# Altium schematic sheet Motherboard.SchDoc
size 762 x 381 mm
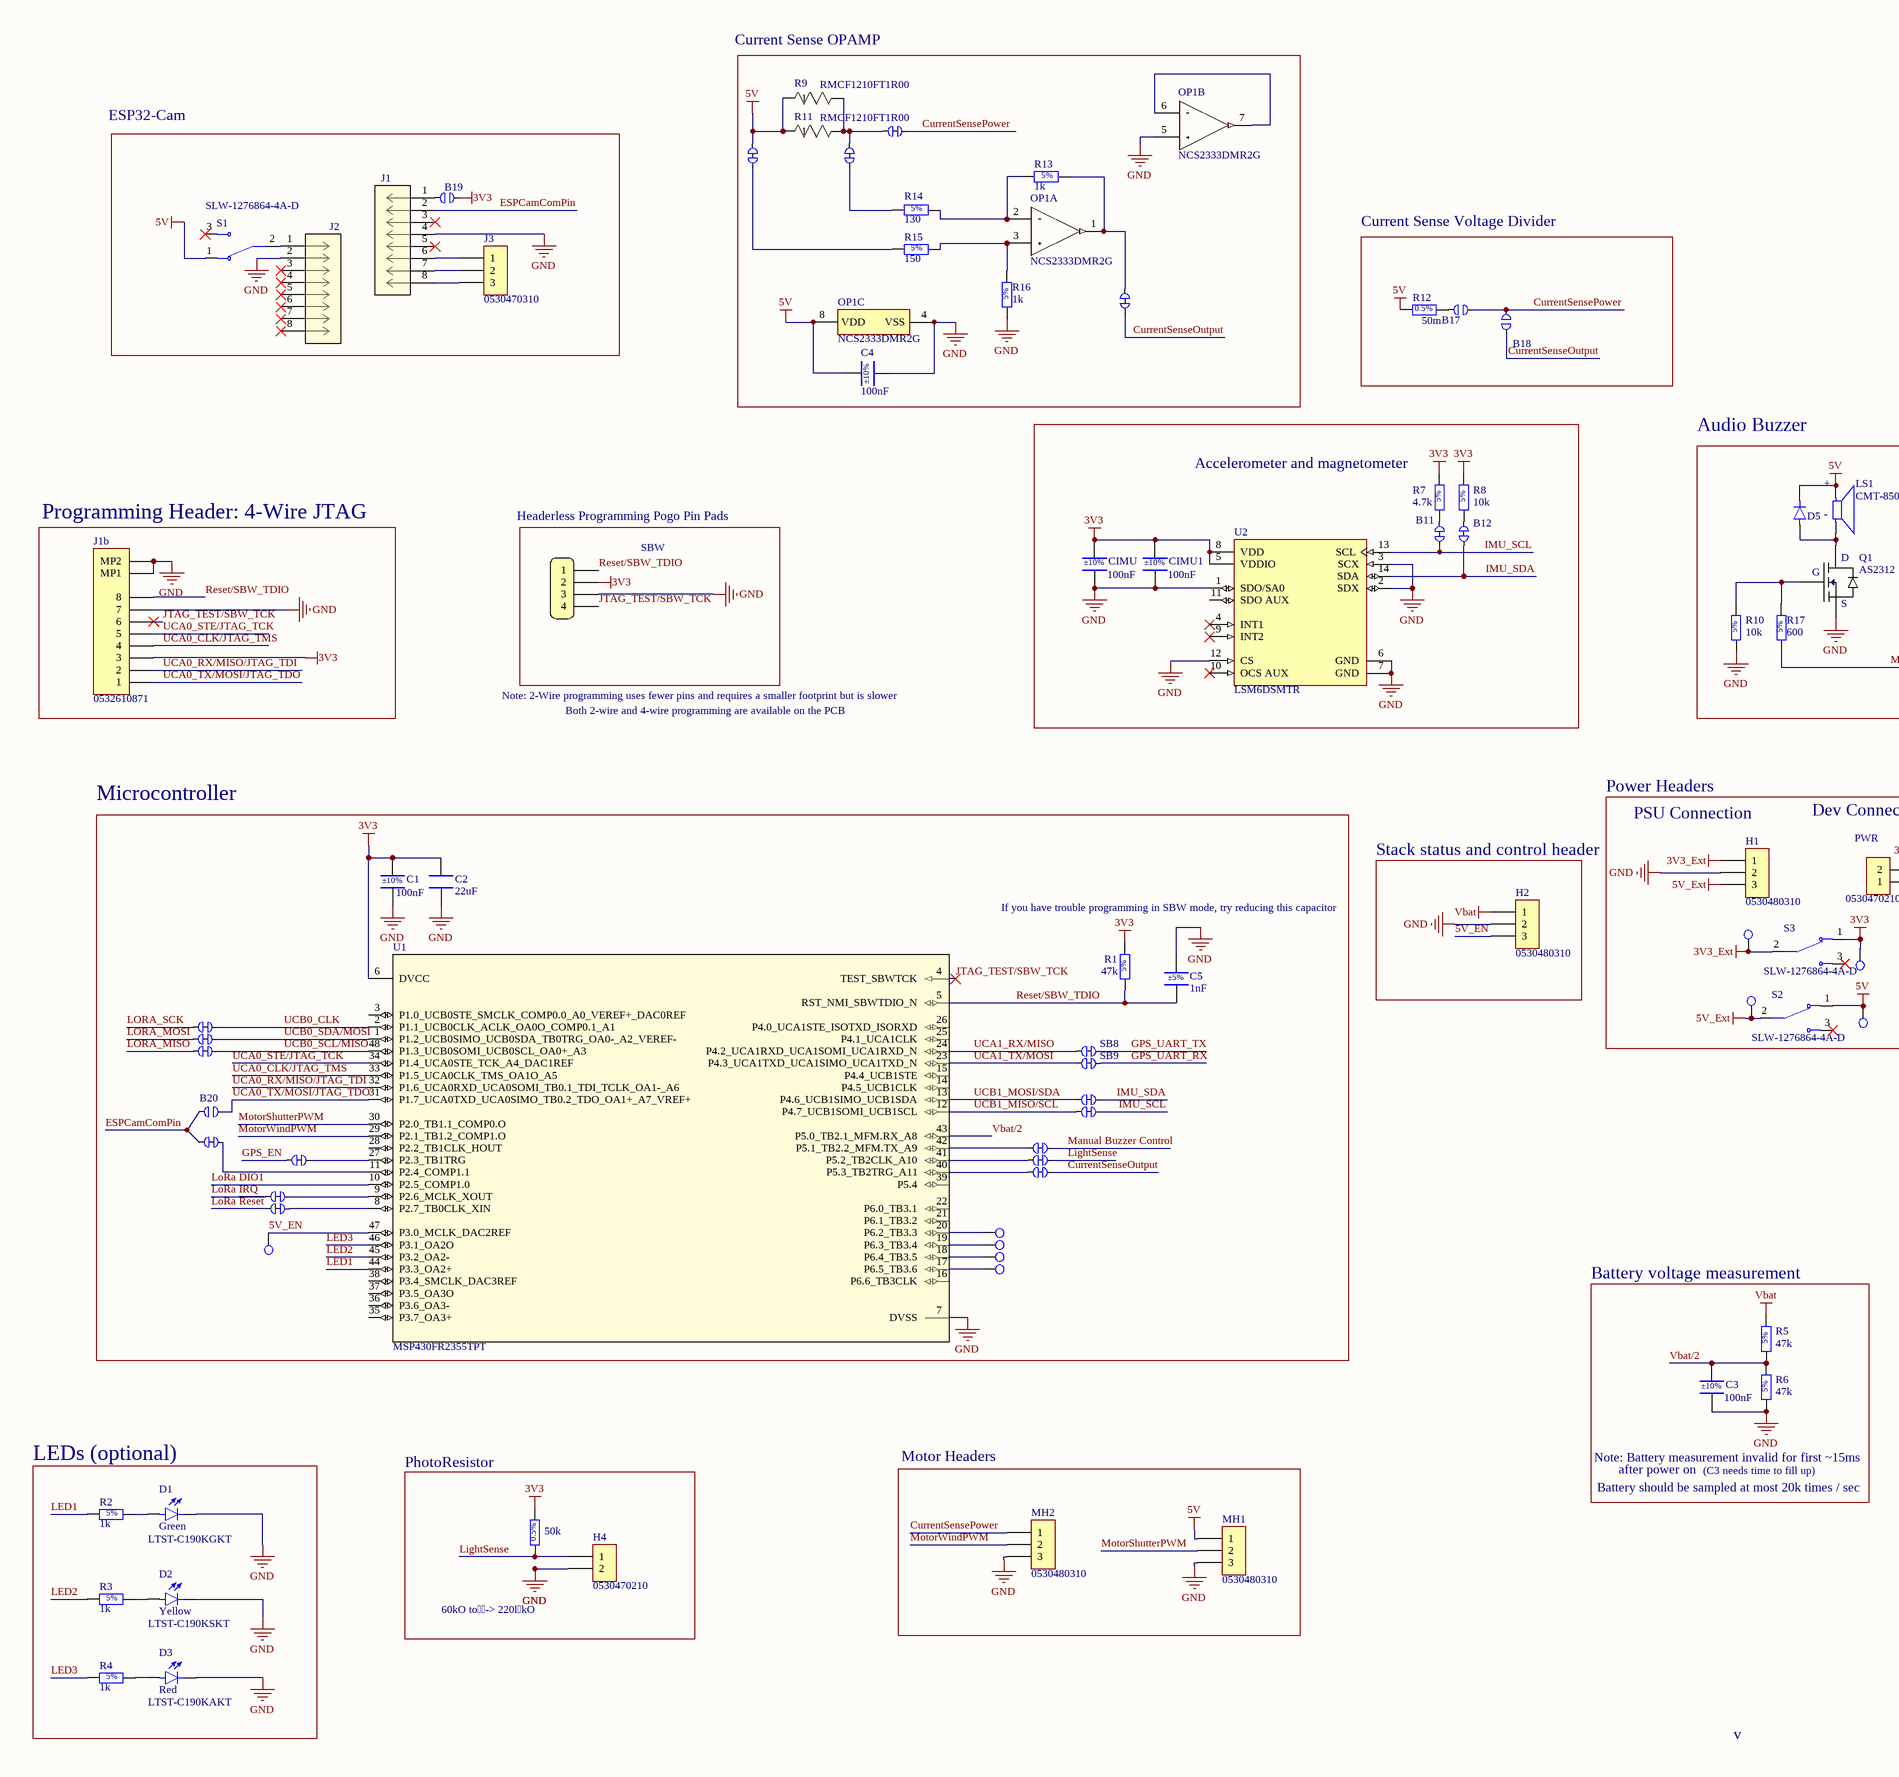
[diagram p0: Motherboard.SchDoc, left]
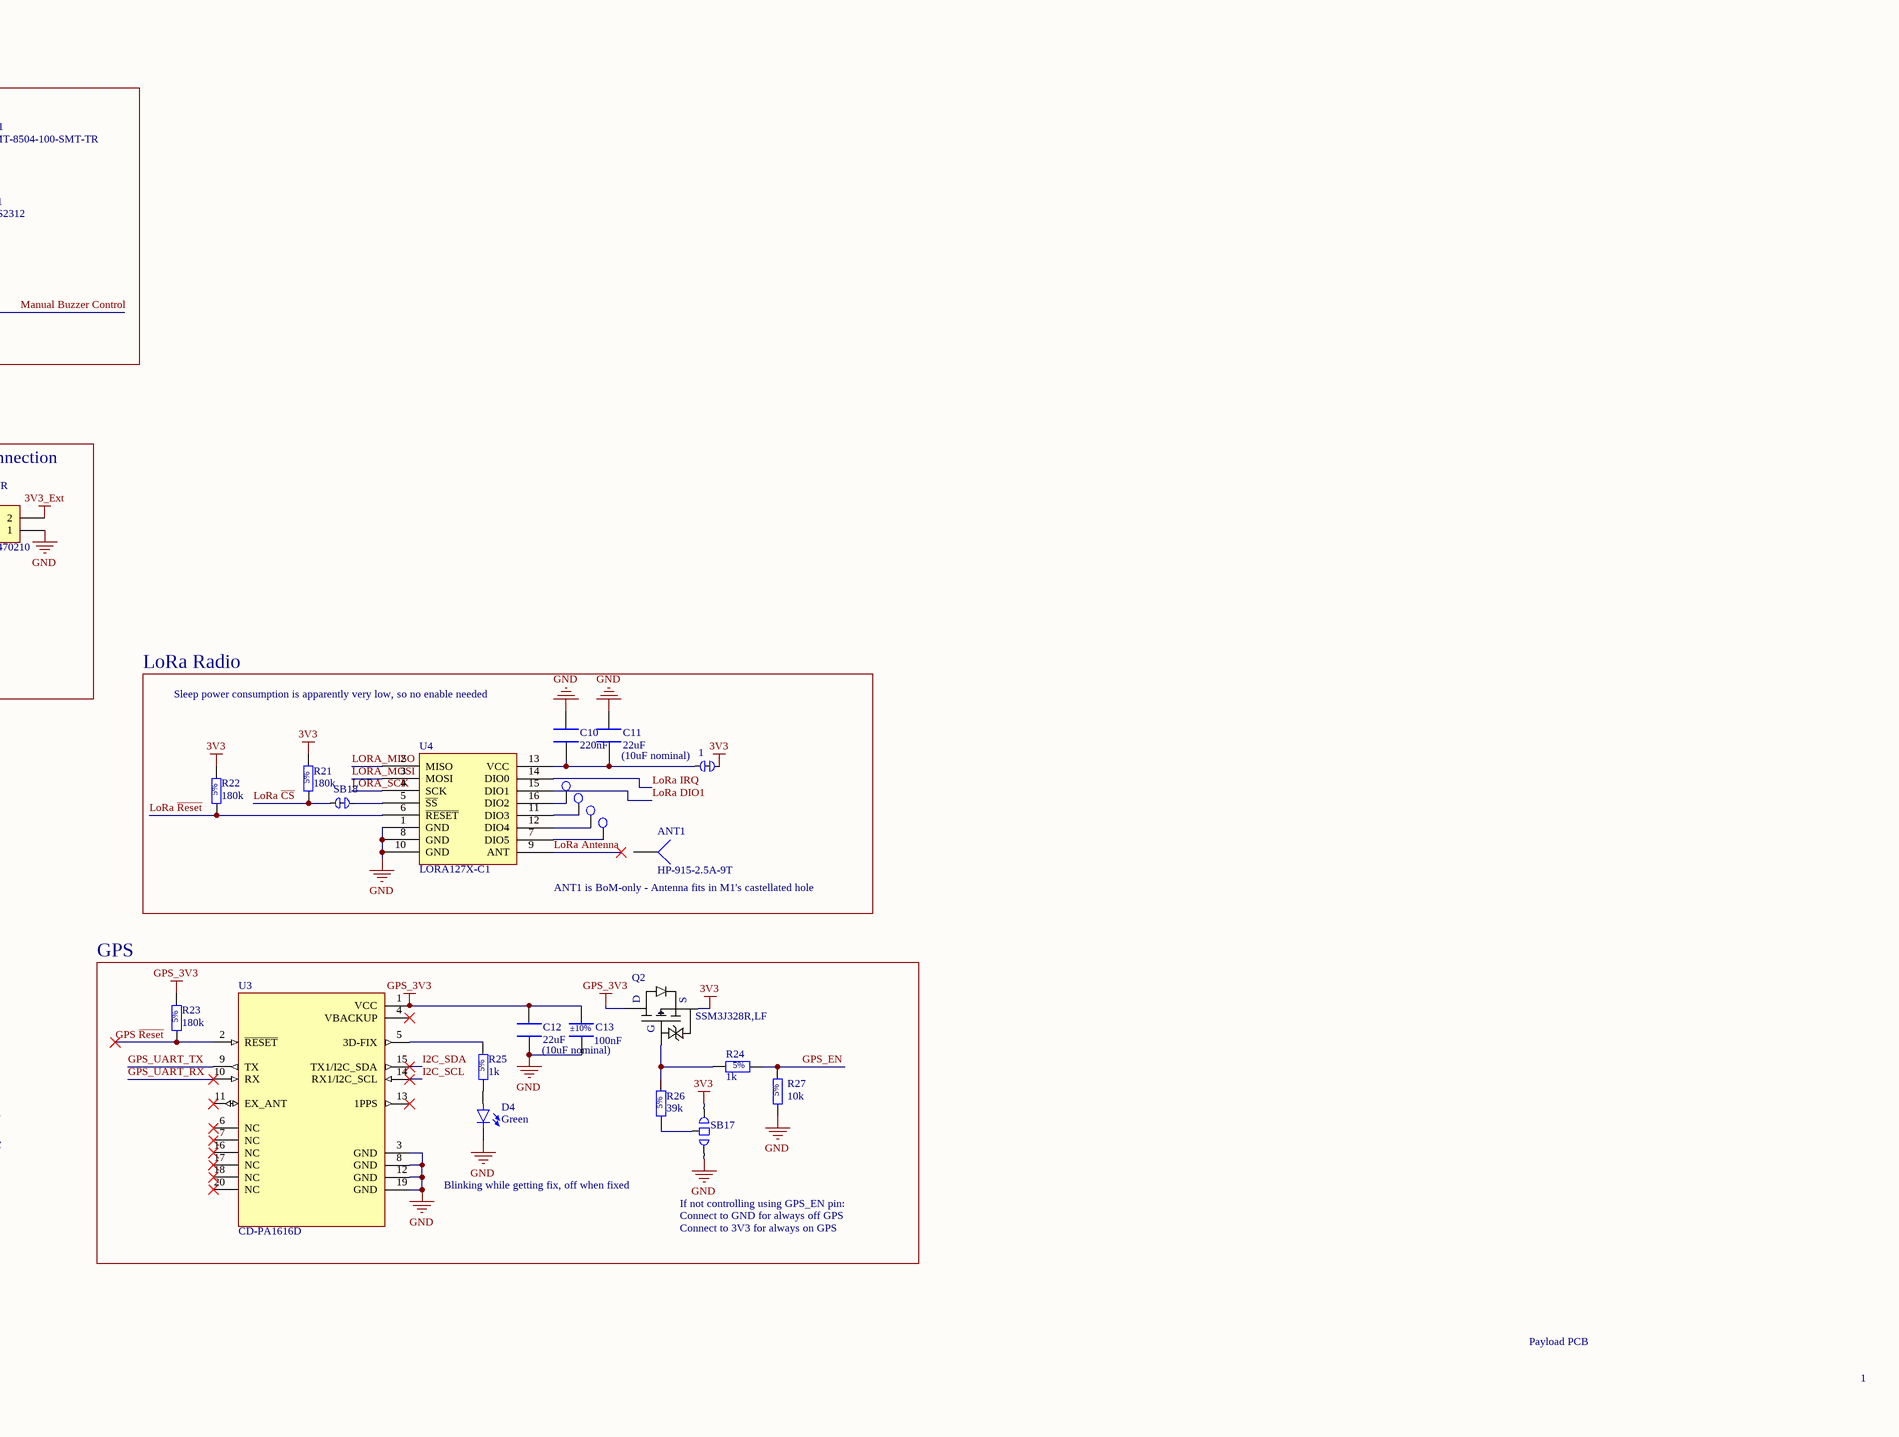
[diagram p1: Motherboard.SchDoc, right]

## Parts
1  Solder Jumper Normally Closed 0201  [Solder Bridge Closed 0201]  (value not drawn)  (net tie, no BOM)
50k  (no value)  [Resistor_0805_2012M-50N]
ANT1  HP-915-2.5A-9T  (mechanical)
B11  Solder Jumper Normally Closed 0201  [Solder Bridge Closed 0201]  (value not drawn)  (net tie, no BOM)
B12  Solder Jumper Normally Closed 0201  [Solder Bridge Closed 0201]  (value not drawn)  (net tie, no BOM)
B17  Solder Jumper Normally Open 0201  [Solder Bridge Open 0201]  (value not drawn)  (no BOM)
B18  Solder Jumper Normally Open 0201  [Solder Bridge Open 0201]  (value not drawn)  (no BOM)
B19  Solder Jumper Normally Open 0201  [Solder Bridge Open 0201]  (value not drawn)  (no BOM)
B20  Solder Jumper Normally Open 0201  [Solder Bridge Open 0201]  (value not drawn)  (no BOM)
C1  100nF  [CAPACITOR_0805_2012M-70N]
C2  22uF  [CAPACITOR_0805_2012M-70N]
C3  100nF  [CAPACITOR_0805_2012M-70N]
C4  100nF  [CAPACITOR_0805_2012M-70N]
C5  1nF  [CAPACITOR_0805_2012M-70N]
C10  220nF  [CAPACITOR_0805_2012M-70N]
C11  22uF  [CAPACITOR_0805_2012M-70N]
C12  22uF  [CAPACITOR_0805_2012M-70N]
C13  100nF  [CAPACITOR_0805_2012M-70N]
CIMU  100nF  [CAPACITOR_0805_2012M-70N]
CIMU1  100nF  [CAPACITOR_0805_2012M-70N]
D1  MF Part No.: LTST-C190KGKT  Colour: Green  [LED_0603_1608M_0.80mm]  (hidden comment: LTST-C190 Series)
D2  MF Part No.: LTST-C190KSKT  Colour: Yellow  [LED_0603_1608M_0.80mm]  (hidden comment: LTST-C190 Series)
D3  MF Part No.: LTST-C190KAKT  Colour: Red  [LED_0603_1608M_0.80mm]  (hidden comment: LTST-C190 Series)
D4  Colour: Green  [LED_0603_1608M_0.80mm]  (hidden comment: LTST-C190 Series)
D5  1N4148W-TP  [SOD123-1.35mm-N]  (value not drawn)
H1  0530480310  [MOLEX_0530480310]
H2  0530480310  [MOLEX_0530480310]
H4  0530470210  [MOLEX_0530470210]
J1  PPTC081LFBN-RC  [CONN_PPTC081LFBN-RC_SUL]  (value not drawn)
J1b  0532610871  [MOLEX_0532610871]
J2  (no value)  [CONN_PPTC081LFBN-RC_SUL]
J3  0530470310  [MOLEX_0530470310]
LS1  CMT-8504-100-SMT-TR  [XDCR_CMT-8504-100-SMT-TR]
MH1  0530480310  [MOLEX_0530480310]
MH2  0530480310  [MOLEX_0530480310]
OP1  NCS2333DMR2G  [MSOP-8N-3mmBody-1.1mm]  (parts A,B,C of 3)
PP2  Headerless Pogo Holes 4-pin  [POGO_4_PIN_HEADER]  (value not drawn)  (no BOM)
PWR  0530470210  [MOLEX_0530470210]
Q1  AS2312  [SOT23-3N-1.15mm]
Q2  SSM3J328R,LF  [SOT23F-3-0.8mm]
R1  47k  [Resistor_0805_2012M-50N]
R2  1k  [Resistor_0805_2012M-50N]
R3  1k  [Resistor_0805_2012M-50N]
R4  1k  [Resistor_0805_2012M-50N]
R5  47k  [Resistor_0805_2012M-50N]
R6  47k  [Resistor_0805_2012M-50N]
R7  4.7k  [Resistor_0805_2012M-50N]
R8  10k  [Resistor_0805_2012M-50N]
R9  RMCF1210FT1R00  [STA_RMCF1210_STP]
R10  10k  [Resistor_0805_2012M-50N]
R11  RMCF1210FT1R00  [STA_RMCF1210_STP]
R12  50m  [RESISTOR_1206_3216M_55N]
R13  1k  [Resistor_0805_2012M-50N]
R14  130  [Resistor_0805_2012M-50N]
R15  150  [Resistor_0805_2012M-50N]
R16  1k  [Resistor_0805_2012M-50N]
R17  600  [Resistor_0805_2012M-50N]
R21  180k  [Resistor_0805_2012M-50N]
R22  180k  [Resistor_0805_2012M-50N]
R23  180k  [Resistor_0805_2012M-50N]
R24  1k  [Resistor_0805_2012M-50N]
R25  1k  [Resistor_0805_2012M-50N]
R26  39k  [Resistor_0805_2012M-50N]
R27  10k  [Resistor_0805_2012M-50N]
S1  SLW-1276864-4A-D  [SW_SLW-1276864-4A-D]
S2  SLW-1276864-4A-D  [SW_SLW-1276864-4A-D]
S3  SLW-1276864-4A-D  [SW_SLW-1276864-4A-D]
SB1  Solder Jumper Normally Closed 0201  [Solder Bridge Closed 0201]  (value not drawn)  (net tie, no BOM)
SB2  Solder Jumper Normally Closed 0201  [Solder Bridge Closed 0201]  (value not drawn)  (net tie, no BOM)
SB3  Solder Jumper Normally Closed 0201  [Solder Bridge Closed 0201]  (value not drawn)  (net tie, no BOM)
SB4  Solder Jumper Normally Closed 0201  [Solder Bridge Closed 0201]  (value not drawn)  (net tie, no BOM)
SB5  Solder Jumper Normally Closed 0201  [Solder Bridge Closed 0201]  (value not drawn)  (net tie, no BOM)
SB6  Solder Jumper Normally Closed 0201  [Solder Bridge Closed 0201]  (value not drawn)  (net tie, no BOM)
SB7  Solder Jumper Normally Closed 0201  [Solder Bridge Closed 0201]  (value not drawn)  (net tie, no BOM)
SB8  Solder Jumper Normally Closed 0201  [Solder Bridge Closed 0201]  (value not drawn)  (net tie, no BOM)
SB9  Solder Jumper Normally Closed 0201  [Solder Bridge Closed 0201]  (value not drawn)  (net tie, no BOM)
SB10  Solder Jumper Normally Closed 0201  [Solder Bridge Closed 0201]  (value not drawn)  (net tie, no BOM)
SB11  Solder Jumper Normally Closed 0201  [Solder Bridge Closed 0201]  (value not drawn)  (net tie, no BOM)
SB12  Solder Jumper Normally Closed 0201  [Solder Bridge Closed 0201]  (value not drawn)  (net tie, no BOM)
SB13  Solder Jumper Normally Closed 0201  [Solder Bridge Closed 0201]  (value not drawn)  (net tie, no BOM)
SB14  Solder Jumper Normally Closed 0201  [Solder Bridge Closed 0201]  (value not drawn)  (net tie, no BOM)
SB15  Solder Jumper Normally Closed 0201  [Solder Bridge Closed 0201]  (value not drawn)  (net tie, no BOM)
SB16  Solder Jumper Normally Closed 0201  [Solder Bridge Closed 0201]  (value not drawn)  (net tie, no BOM)
SB17  Solder Jumper 3-pin Normally Open 0201  [Solder Bridge 3-pin Open 0201]  (value not drawn)  (no BOM)
SB18  Solder Jumper Normally Closed 0201  [Solder Bridge Closed 0201]  (value not drawn)  (net tie, no BOM)
SB19  Solder Jumper Normally Closed 0201  [Solder Bridge Closed 0201]  (value not drawn)  (net tie, no BOM)
SB20  Solder Jumper Normally Closed 0201  [Solder Bridge Closed 0201]  (value not drawn)  (net tie, no BOM)
T1  Test Pad  [Test Pad]  (value not drawn)  (no BOM)
T2  Test Pad  [Test Pad]  (value not drawn)  (no BOM)
T3  Test Pad  [Test Pad]  (value not drawn)  (no BOM)
T4  Test Pad  [Test Pad]  (value not drawn)  (no BOM)
T5  Test Pad  [Test Pad]  (value not drawn)  (no BOM)
T6  Test Pad  [Test Pad]  (value not drawn)  (no BOM)
T7  Test Pad  [Test Pad]  (value not drawn)  (no BOM)
T8  Test Pad  [Test Pad]  (value not drawn)  (no BOM)
T9  Test Pad  [Test Pad]  (value not drawn)  (no BOM)
T10  Test Pad  [Test Pad]  (value not drawn)  (no BOM)
T11  Test Pad  [Test Pad]  (value not drawn)  (no BOM)
T12  Test Pad  [Test Pad]  (value not drawn)  (no BOM)
T?  Test Pad  [Test Pad]  (value not drawn)  (no BOM)
U1  MSP430FR2355TPT  [PT0048A_L]
U2  LSM6DSMTR  [FP-LGA-14L-DM00249496-MFG]
U3  CD-PA1616D  [XCVR_CD-PA1616D]
U4  LORA127X-C1  [LoRa127X-C1]

## Blocks framed on the sheet
Current Sense Voltage Divider: B17 B18 R12
Accelerometer and magnetometer: B11 B12 CIMU CIMU1 R7 R8 U2
Audio Buzzer: D5 LS1 Q1 R10 R17
Programming Header: 4-Wire JTAG: J1b
SBW: PP2
Microcontroller: B20 C1 C2 C5 R1 SB5-SB16 SB19 SB20 T5-T8 T? U1
Stack status and control header: H2
LoRa Radio: 1 ANT1 C10 C11 R21 R22 SB18 T1-T4 U4
Battery voltage measurement: C3 R5 R6
GPS: C12 C13 D4 Q2 R23-R27 SB17 U3
LEDs (optional): D1-D3 R2-R4
PhotoResistor: 50k H4
Motor Headers: MH1 MH2

## Nets
3V3: 1.2 50k.2 B19.2 C1.2 C2.2 CIMU.2 CIMU1.2 J1b.3 PP2.2 Q2.2(S) R1.2 R7.2 R8.2 R21.2 R22.2 S3.1 SB17.2 T9.1 U1.6(DVCC) U2.5(VDDIO) U2.8(VDD)
3V3_Ext: H1.1 PWR.2 S3.2 T12.1
5V: C4.2 D5.C LS1.P MH1.1 OP1.8(VDD) R9.1 R11.1 R12.1 S1.1 S2.1 SB2.2 T10.1
5V_Ext: H1.3 S2.2 T11.1
GND: C1.1 C2.1 C3.1 C4.1 C5.2 C10.2 C11.2 C12.1 C13.1 CIMU.1 CIMU1.1 D1.C D2.C D3.C D4.C H1.2 H2.2 H4.2 J1.4 J1b.7 J1b.MP1 J1b.MP2 J2.2 MH1.3 MH2.3 OP1.4(VSS) OP1.5(IN2+) PP2.3 PWR.1 Q1.2(S) R6.1 R10.1 R16.1 R27.1 SB17.3 U1.7(DVSS) U2.1(SDO/SA0) U2.2(SDX) U2.3(SCX) U2.6(GND) U2.7(GND) U2.12(CS) U3.3(GND) U3.8(GND) U3.12(GND) U3.19(GND) U4.1(GND) U4.8(GND) U4.10(GND)
GPS_3V3: C12.2 C13.2 Q2.3(D) R23.2 U3.1(VCC)
Vbat: H2.1 R5.2
5V_EN: H2.3 T?.1 U1.47(P3.0_MCLK_DAC2REF)
CurrentSenseOutput: B18.2 SB4.1 SB20.2
CurrentSensePower: B17.1 B18.1 MH2.1 SB1.2
ESPCamComPin: B20.2 J1.2 SB12.1
GPS ~{Reset}: R23.1 U3.2(~{RESET})
GPS_EN: R24.2 R27.2 SB13.1
GPS_UART_RX: SB9.2 U3.10(RX)
GPS_UART_TX: SB8.2 U3.9(TX)
I2C_SCL: U3.14(RX1/I2C_SCL)
I2C_SDA: U3.15(TX1/I2C_SDA)
IMU_SCL: B11.1 SB11.2 U2.13(SCL)
IMU_SDA: B12.2 SB10.2 U2.14(SDA)
JTAG_TEST/SBW_TCK: J1b.6 PP2.4 U1.4(TEST_SBWTCK)
LED1: R2.1 U1.44(P3.3_OA2+)
LED2: R3.1 U1.45(P3.2_OA2-)
LED3: R4.1 U1.46(P3.1_OA2O)
LightSense: 50k.1 H4.1 SB14.2
LoRa Antenna: U4.9(ANT)
LoRa ~{CS}: R21.1 SB18.1
LoRa DIO1: U1.10(P2.5_COMP1.0) U4.15(DIO1)
LoRa IRQ: SB15.1 U4.14(DIO0)
LoRa ~{Reset}: R22.1 SB16.1 U4.6(~{RESET})
LORA_MISO: SB7.1 U4.2(MISO)
LORA_MOSI: SB6.1 U4.3(MOSI)
LORA_SCK: SB5.1 U4.4(SCK)
Manual Buzzer Control: R17.1 SB19.2
MotorShutterPWM: MH1.2 U1.30(P2.0_TB1.1_COMP0.O)
MotorWindPWM: MH2.2 U1.29(P2.1_TB1.2_COMP1.O)
Reset/SBW_TDIO: C5.1 J1b.8 PP2.1 R1.1 U1.5(RST_NMI_SBWTDIO_N)
UCA0_CLK/JTAG_TMS: J1b.4 U1.33(P1.5_UCA0CLK_TMS_OA1O_A5)
UCA0_RX/MISO/JTAG_TDI: J1b.2 U1.32(P1.6_UCA0RXD_UCA0SOMI_TB0.1_TDI_TCLK_OA1-_A6)
UCA0_STE/JTAG_TCK: J1b.5 U1.34(P1.4_UCA0STE_TCK_A4_DAC1REF)
UCA0_TX/MOSI/JTAG_TDO: B20.1 J1b.1 U1.31(P1.7_UCA0TXD_UCA0SIMO_TB0.2_TDO_OA1+_A7_VREF+)
UCA1_RX/MISO: SB8.1 U1.24(P4.2_UCA1RXD_UCA1SOMI_UCA1RXD_N)
UCA1_TX/MOSI: SB9.1 U1.23(P4.3_UCA1TXD_UCA1SIMO_UCA1TXD_N)
UCB0_CLK: SB5.2 U1.2(P1.1_UCB0CLK_ACLK_OA0O_COMP0.1_A1)
UCB0_SCL/MISO: SB7.2 U1.48(P1.3_UCB0SOMI_UCB0SCL_OA0+_A3)
UCB0_SDA/MOSI: SB6.2 U1.1(P1.2_UCB0SIMO_UCB0SDA_TB0TRG_OA0-_A2_VEREF-)
UCB1_MISO/SCL: SB11.1 U1.12(P4.7_UCB1SOMI_UCB1SCL)
UCB1_MOSI/SDA: SB10.1 U1.13(P4.6_UCB1SIMO_UCB1SDA)
Vbat/2: C3.2 R5.1 R6.2 U1.43(P5.0_TB2.1_MFM.RX_A8)
Net1_1: 1.1 C10.1 C11.1 U4.13(VCC)
NetB11_2: B11.2 R7.1
NetB12_1: B12.1 R8.1
NetB17_2: B17.2 R12.2
NetB19_1: B19.1 J1.1
NetD1_A: D1.A R2.2
NetD2_A: D2.A R3.2
NetD3_A: D3.A R4.2
NetD4_A: D4.A R25.1
NetD5_A: D5.A LS1.N Q1.3(D)
NetJ1_6: J1.6 J3.1
NetJ1_7: J1.7 J3.2
NetJ1_8: J1.8 J3.3
NetJ2_1: J2.1 S1.2
NetOP1_1: OP1.1(OUT1) R13.2 SB4.2
NetOP1_2: OP1.2(IN1-) R13.1 R14.2
NetOP1_3: OP1.3(IN1+) R15.2 R16.2
NetOP1_6: OP1.6(IN2-) OP1.7(OUT1)
NetQ1_1: Q1.1(G) R10.2 R17.2
NetQ2_1: Q2.1(G) R24.1 R26.2
NetR9_2: R9.2 R11.2 SB1.1 SB3.2
NetR14_1: R14.1 SB3.1
NetR15_1: R15.1 SB2.1
NetR25_2: R25.2 U3.5(3D-FIX)
NetR26_1: R26.1 SB17.1(Common)
NetSB12_2: SB12.2 U1.11(P2.4_COMP1.1)
NetSB13_2: SB13.2 U1.27(P2.3_TB1TRG)
NetSB14_1: SB14.1 U1.41(P5.2_TB2CLK_A10)
NetSB15_2: SB15.2 U1.9(P2.6_MCLK_XOUT)
NetSB16_2: SB16.2 U1.8(P2.7_TB0CLK_XIN)
NetSB18_2: SB18.2 U4.5(~{SS})
NetSB19_1: SB19.1 U1.42(P5.1_TB2.2_MFM.TX_A9)
NetSB20_1: SB20.1 U1.40(P5.3_TB2TRG_A11)
NetT1_1: T1.1 U4.16(DIO2)
NetT2_1: T2.1 U4.11(DIO3)
NetT3_1: T3.1 U4.12(DIO4)
NetT4_1: T4.1 U4.7(DIO5)
NetT5_1: T5.1 U1.20(P6.2_TB3.3)
NetT6_1: T6.1 U1.19(P6.3_TB3.4)
NetT7_1: T7.1 U1.18(P6.4_TB3.5)
NetT8_1: T8.1 U1.17(P6.5_TB3.6)

Not connected (* = marked no-connect by the designer): ANT1 1; J1 3* 5*; J2 3* 4* 5* 6* 7* 8*; S1 3*; S2 3*; S3 3*; U1 3(P1.0_UCB0STE_SMCLK_COMP0.0_A0_VEREF+_DAC0REF) 14(P4.5_UCB1CLK) 15(P4.4_UCB1STE) 16(P6.6_TB3CLK) 21(P6.1_TB3.2) 22(P6.0_TB3.1) 25(P4.1_UCA1CLK) 26(P4.0_UCA1STE_ISOTXD_ISORXD) 28(P2.2_TB1CLK_HOUT) 35(P3.7_OA3+) 36(P3.6_OA3-) 37(P3.5_OA3O) 38(P3.4_SMCLK_DAC3REF) 39(P5.4); U2 4(INT1)* 9(INT2)* 10(OCS_AUX)* 11(SDO_AUX); U3 4(VBACKUP)* 6(NC)* 7(NC)* 11(EX_ANT)* 13(1PPS)* 16(NC)* 17(NC)* 18(NC)* 20(NC)*

## Notes on the sheet
- Current Sense OPAMP
- ESP32-Cam
- (near PP2) Headerless Programming Pogo Pin Pads
- Note: 2-Wire programming uses fewer pins and requires a smaller footprint but is slower
- Both 2-wire and 4-wire programming are available on the PCB
- Power Headers
- (near H1) PSU Connection
- Dev Connection
- If you have trouble programming in SBW mode, try reducing this capacitor
- (near C10) Sleep power consumption is apparently very low, so no enable needed
- (near 1) (10uF nominal)
- ANT1 is BoM-only - Antenna fits in M1's castellated hole
- (10uF nominal)
- Note: Battery measurement invalid for first ~15ms
- Battery should be sampled at most 20k times / sec
- after power on
- (C3 needs time to fill up)
- Blinking while getting fix, off when fixed
- Connect to GND for always off GPS
- Connect to 3V3 for always on GPS
- (near SB17) If not controlling using GPS_EN pin:
- 60kO to-> 220lkO
- Payload PCB
- v
- 1
- (in symbol CMT-8504-100-SMT-TR) +; -

## Library data of the parts
50k = RG2012P-xxx-D-T5 Series: Passive - Resistor Series, 0805, 0.5%, 10 - 1M, E24, 0.063W, 1/8W, ±25ppm/°C, -55°C ~ 155°C, 0805 (2012 Metric); APSS Standard Part: APSS Standard; Value Range: 10 ~ 1M; Rated Voltage: 150V; Tolerance: 0.5%; Power: 1/8W; E Series: E24; Temp Range: -55°C ~ 155°C; Supplier 1: Digikey; Package: 0805; Temperature Coefficient: ±25ppm/°C
ANT1 = Socket: Spring Antenna; MF Part No.: HP-915-2.5A-9T
C1 C3 C4 C13 CIMU CIMU1 = Generic Capacitor: MF Part No.: C0805C104K5RAC7800; Tolerance: ±10%; Temperature Coefficient: X7R; Rated Voltage: 50V; Capacitance at Rated Voltage: 40%; Temp Range: -55°C ~ 125°C; Supplier 1: Digikey; Supplier 1 Part No.: 399-C0805C104K5RAC7800CT-ND; Package: 0805; Value: 100nF
C2 C11 C12 = C0805C226M9PACTU: Passive - Capacitor, X5R, 22uF Max, 6.3V, 0805 (2012 Metric), ±20%, -55°C ~ 85°C. 8.8uF @ 5V; APSS Standard Part: APSS Standard; Capacitance at Rated Voltage: 30%; Tolerance: ±20%; Temperature Coefficient: X5R; Rated Voltage: 6.3V; Temp Range: -55°C ~ 85°C; Package: 0402; Supplier 1: Digikey; Supplier 1 Part No.: 399-C0805C226M9PAC7800CT-ND; MF Part No.: C0805C226M9PACTU; Value: 22uF
C5 = Generic Capacitor: MF Part No.: 399-C0805C102J5GAC7800CT-ND; Tolerance: ±5%; Temperature Coefficient: X7R; Rated Voltage: 50V; Capacitance at Rated Voltage: 100%; Temp Range: -55°C ~ 125°C; Supplier 1: Digikey; Supplier 1 Part No.: 399-C0805C102J5GAC7800CT-ND; Package: 0805; Value: 1nF
C10 = C0805C224K1RAC7800: Passive - Capacitor, X7R, 220nF Max, 100V, 0805 (2012 Metric), ±10%, -55°C ~ 85°C. 200nF @ 10V, 110nF @ 50V, 55nF @ 100V; APSS Standard Part: APSS Standard; Capacitance at Rated Voltage: 25%; Tolerance: ±10%; Temperature Coefficient: X7R; Rated Voltage: 100V; Temp Range: -55°C ~ 85°C; Package: 0805; Supplier 1: Digikey; Supplier 1 Part No.: 399-C0805C224K1RAC7800CT-ND; MF Part No.: C0805C224K1RAC7800; Value: 220nF
D1-D3 = LTST-C190 Series: Diode - LED, 0603; APSS Standard Part: APSS Standard; Temp Range: -30°C ~ 85°C; Rated Voltage: 5V Reverse; Package: 0603; Supplier 1: Digikey
D4 = LTST-C190 Series: Diode - LED, 0603; MF Part No.: LTST-C190KGKT; APSS Standard Part: APSS Standard; Temp Range: -30°C ~ 85°C; Rated Voltage: 5V Reverse; Package: 0603; Supplier 1: Digikey
D5 = 1N4148W-TP: Diode - Low Reverse Leakage, 1.25 Vf @ 150 mA, 1 µA Reverse @ 75 V, SOD-123; APSS Standard Part: APSS Standard; Temp Range: -65°C ~ 150°C; Rated Voltage: 100V Reverse; MF Part No.: 1N4148W-TP; Package: SOD-123; Supplier 1: Digikey; Supplier 1 Part No.: 1N4148WTPMSCT-ND
H1 H2 MH1 MH2 = 0530480310: Header - Picoblade 03-pin, TH, RA; APSS Standard Part: APSS Standard; Pitch: 1.25mm; Mounting Type: Through-hole; Orientation: Right Angle; Pins: 3; Supplier 1: Digikey; Supplier 1 Part No.: WM1743-ND; MF Part No.: 0530480310
H4 PWR = 0530470210: Header - Picoblade 02-pin, TH, STR; APSS Standard Part: APSS Standard; Pitch: 1.25mm; Mounting Type: Through-hole; Orientation: Straight; Pins: 2; Supplier 1: Digikey; Supplier 1 Part No.: 530470210
  H4: MF Part No.: 0530470210
J1 J2 = PPTC081LFBN-RC: No Description Available; Mfr_Name: Sullins; RefDes: RefDes; Type: Type
J1b = 0532610871: Header - Picoblade 08-pin, SMT, RA; APSS Standard Part: APSS Standard; Pitch: 1.25mm; Mounting Type: Surface Mount; Orientation: Right Angle; Pins: 8; Supplier 1: Digikey; Supplier 1 Part No.: WM7626CT-ND; MF Part No.: 0532610871
J3 = 0530470310: Header - Picoblade 03-pin, TH, STR; APSS Standard Part: APSS Standard; Pitch: 1.25mm; Mounting Type: Through-hole; Orientation: Straight; Pins: 3; Supplier 1: Digikey; Supplier 1 Part No.: WM1732-ND; MF Part No.: 0530470310
LS1 = CMT-8504-100-SMT-TR: 8.5 mm, 5 Vo-p, 100 dB, Surface Mount (SMT), Magnetic Audio Transducer Buzzer; MF Part No.: CMT-8504-100-SMT-TR
OP1 = NCS2333DMR2G: IC - Opamp, Precision, 2-Channel, Zero Drift, 270kHz GBWP, RRIO, 1.8V to 5.5V, -40 to 125, 8-MSOP; APSS Standard Part: APSS Standard; Temp Range: -40°C ~ 125°C; MF Part No.: NCS2333DMR2G; Package: MSOP-8 0.65mm; Supplier 1: Digikey; Supplier 1 Part No.: 488-NCS2333DMR2GCT-ND; Rated Voltage: 5.5V
Q1 = AS2312: Transistor - MOSFET, N-Channel AS2312; APSS Standard Part: APSS Standard; Temp Range: 0°C ~ 150°C (TJ); Rated Voltage: 20 Vds; Power: 1.2W; Package: SOT23-3; MF Part No.: AS2312; Supplier 1: Digikey; Supplier 1 Part No.: 4530-AS2312CT-ND
Q2 = SSM3J328R,LF: Transistor - MOSFET, P-Channel SSM3J328R,LF; APSS Standard Part: APSS Standard; Temp Range: 0°C ~ 150°C (TJ); Rated Voltage: 20 Vds; Power: 1W; MF Part No.: SSM3J328R,LF; Package: SOT23-3; Supplier 1: Digikey; Supplier 1 Part No.: SSM3J328RLFCT-ND
R1 R26 = RMCF0805JT Series: Passive - Resistor Series, 0805, 5%, 100m - 22M, E24, 0.063W, 1/16W, ±200ppm/°C, -55°C ~ 155°C, 0805 (2012 Metric); MF Part No.: RMCF0805JT39K0; APSS Standard Part: APSS Standard; Power: 1/8W; Value Range: 100m ~ 22M; Rated Voltage: 150V; Tolerance: 5%; E Series: E24; Temp Range: -55°C ~ 155°C; Supplier 1: Digikey; Package: 0805; Temperature Coefficient: ±200ppm/°C
  R1: Value: 47k
  R26: Value: 39k
R2-R4 R13-R17 R24 R25 = RMCF0805JT Series: Passive - Resistor Series, 0805, 5%, 100m - 22M, E24, 0.063W, 1/16W, ±200ppm/°C, -55°C ~ 155°C, 0805 (2012 Metric); MF Part No.: RMCF0805JT1K00; APSS Standard Part: APSS Standard; Power: 1/8W; Value Range: 100m ~ 22M; Rated Voltage: 150V; Tolerance: 5%; E Series: E24; Temp Range: -55°C ~ 155°C; Supplier 1: Digikey; Package: 0805; Temperature Coefficient: ±200ppm/°C
  R2-R4 R13 R16 R24 R25: Value: 1k
  R14: Value: 130
  R15: Value: 150
  R17: Value: 600
R5 = RMCF0805JT Series: Passive - Resistor Series, 0805, 5%, 100m - 22M, E24, 0.063W, 1/16W, ±200ppm/°C, -55°C ~ 155°C, 0805 (2012 Metric); MF Part No.: RMCF0805JT147K0; APSS Standard Part: APSS Standard; Power: 1/8W; Value Range: 100m ~ 22M; Rated Voltage: 150V; Tolerance: 5%; E Series: E24; Temp Range: -55°C ~ 155°C; Supplier 1: Digikey; Package: 0805; Temperature Coefficient: ±200ppm/°C; Value: 47k
R6 = RMCF0805JT Series: Passive - Resistor Series, 0805, 5%, 100m - 22M, E24, 0.063W, 1/16W, ±200ppm/°C, -55°C ~ 155°C, 0805 (2012 Metric); MF Part No.: RMCF0805JT47K0; APSS Standard Part: APSS Standard; Power: 1/8W; Value Range: 100m ~ 22M; Rated Voltage: 150V; Tolerance: 5%; E Series: E24; Temp Range: -55°C ~ 155°C; Supplier 1: Digikey; Package: 0805; Temperature Coefficient: ±200ppm/°C; Value: 47k
R7 R8 R10 R27 = RMCF0805JT Series: Passive - Resistor Series, 0805, 5%, 100m - 22M, E24, 0.063W, 1/16W, ±200ppm/°C, -55°C ~ 155°C, 0805 (2012 Metric); MF Part No.: RMCF0805JT4K70; APSS Standard Part: APSS Standard; Power: 1/8W; Value Range: 100m ~ 22M; Rated Voltage: 150V; Tolerance: 5%; E Series: E24; Temp Range: -55°C ~ 155°C; Supplier 1: Digikey; Package: 0805; Temperature Coefficient: ±200ppm/°C
  R7: Value: 4.7k
  R8 R10 R27: Value: 10k
R9 R11 = RMCF1210FT1R00: No Description Available; Mfr_Name: Stackpole International
R12 = TNPW1206xxxxDE Series: Passive - Resistor Series, 1206, 0.5%, 1R - 2M, E24+E96, 0.52W, 1/2W, ±25ppm/°C, -55°C ~ 155°C, 0805 (3216 Metric); APSS Standard Part: APSS Standard; Value Range: 1R ~ 2M; Rated Voltage: 200V; Temperature Coefficient: ±200ppm/°C; Tolerance: 0.5%; Power: 0.52W; E Series: E24+E96; Temp Range: -55°C ~ 155°C; Supplier 1: Digikey; Package: 0805; MF Part No.: TNPW1206xxxxDE; Value: 50m
R21-R23 = RMCF0805JT Series: Passive - Resistor Series, 0805, 5%, 100m - 22M, E24, 0.063W, 1/16W, ±200ppm/°C, -55°C ~ 155°C, 0805 (2012 Metric); MF Part No.: RMCF0805JT180K; APSS Standard Part: APSS Standard; Power: 1/8W; Value Range: 100m ~ 22M; Rated Voltage: 150V; Tolerance: 5%; E Series: E24; Temp Range: -55°C ~ 155°C; Supplier 1: Digikey; Package: 0805; Temperature Coefficient: ±200ppm/°C; Value: 180k
U1 = MSP430FR2355IPT: Rated Voltage: 1.8V ~ 3.6V; Temp Range: -40°C ~ 105°C (TA); MF Part No.: MSP430FR2355TPT; Package: LQFP-48; Supplier 1: Digikey; Supplier 1 Part No.: 296-50260-ND
U2 = CMP-12177-000008-1: IMU ACCEL/GYRO I2C/SPI 14LGA; Manufacturer: STMicroelectronics; Operating Supply Current: 0.29-0.65mA; Gyro Range: 125/250/500/1000/2000°/s; Sensor Output: I2C,SPI; Accel Range: 2/4/8/16g; Min Supply Voltage: 1.62V; Resolution: 16bits; Sensor Type: Temperature,Accelerometer,Gyroscope; Max Supply Voltage: 3.6V; Manufacturer Part Number: LSM6DSMTR; Octopart: https://octopart.com/lsm6dsmtr-stmicroelectronics-66358194; Height: 0.86mm; Category: IC; Lead Free: Yes; Temperature: -40°C to +85°C; Temperature Range Low: -40°C; ComponentLink2Description: Datasheet; ComponentLink2URL: https://www.st.com/resource/en/datasheet/lsm6dsm.pdf; Digikey Description: IMU ACCEL/GYRO I2C/SPI 14LGA; Footprint Url: https://www.st.com/content/ccc/resource/technical/document/technical_note/73/17/9c/16/dd/96/4a/01/CD00134799.pdf/files/CD00134799.pdf/jcr:content/translations/en.CD00134799.pdf; Device Class L1: Sensors; Device Class L2: Motion Sensors; Temperature Range High: +85°C; Mouser Description: LSM6DSM Series 3.6 V I2C/SPI 3D Accelerometer and 3D Gyroscope - LGA-14; Device Class L3: Inertial Measurement Units (IMUs); Automotive: No; Package: LGA-14L-DM00249496; RoHS: TRUE
U3 = CD-PA1616D: CD-PA1616D GNSS patch antenna module; MF Part No.: CD-PA1616D
U4 = LORA127X-C1: LoRa transceiver; MF Part No.: LORA127X-C1
1 B11 B12 SB1-SB16 SB18-SB20 = Solder Jumper Normally Closed 0201: DEBUG: DEBUG
B17-B20 = Solder Jumper Normally Open 0201: DEBUG: DEBUG
S1-S3 = SLW-1276864-4A-D: Package: None; Price: None; Value: *; MP: SLW-1276864-4A-D; Availability: Unavailable
SB17 = Solder Jumper 3-pin Normally Open 0201: DEBUG: DEBUG